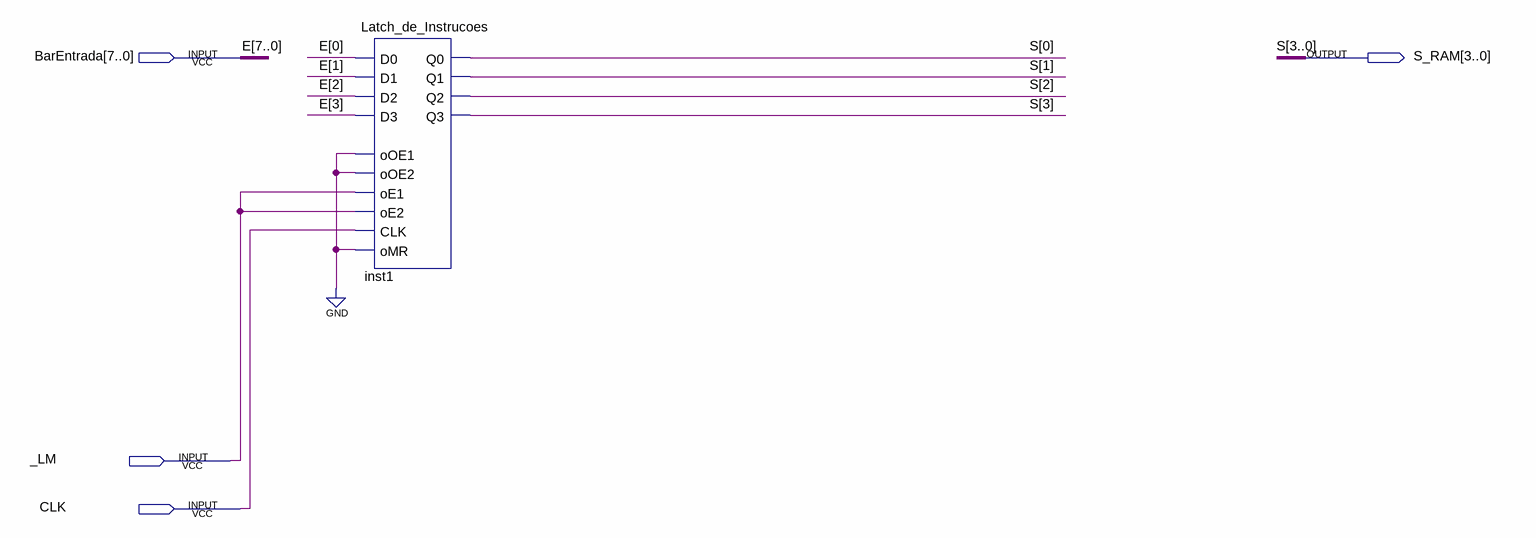
[diagram p0: schematic sheet]
// Quartus schematic REM.bdf as structural Verilog: 1 symbols, 4 pins
module REM (
  input  [7:0] BarEntrada,
  input  _LM,
  input  CLK,
  output [3:0] S_RAM
);

  Latch_de_Instrucoes inst1 (
    .D0(BarEntrada[0]), .D1(BarEntrada[1]), .D2(BarEntrada[2]), .D3(BarEntrada[3]), .oOE1(1'b0), .oOE2(1'b0),
    .oE1(_LM), .oE2(_LM), .CLK(CLK), .oMR(1'b0), .Q0(S_RAM[0]), .Q1(S_RAM[1]), .Q2(S_RAM[2]), .Q3(S_RAM[3]));

  // Other names for the same wires on the sheet: E[7:0] = BarEntrada; S[3:0] = S_RAM
endmodule
